# EAGLE design FixedItFinalFinal (EAGLE 9.6.2)
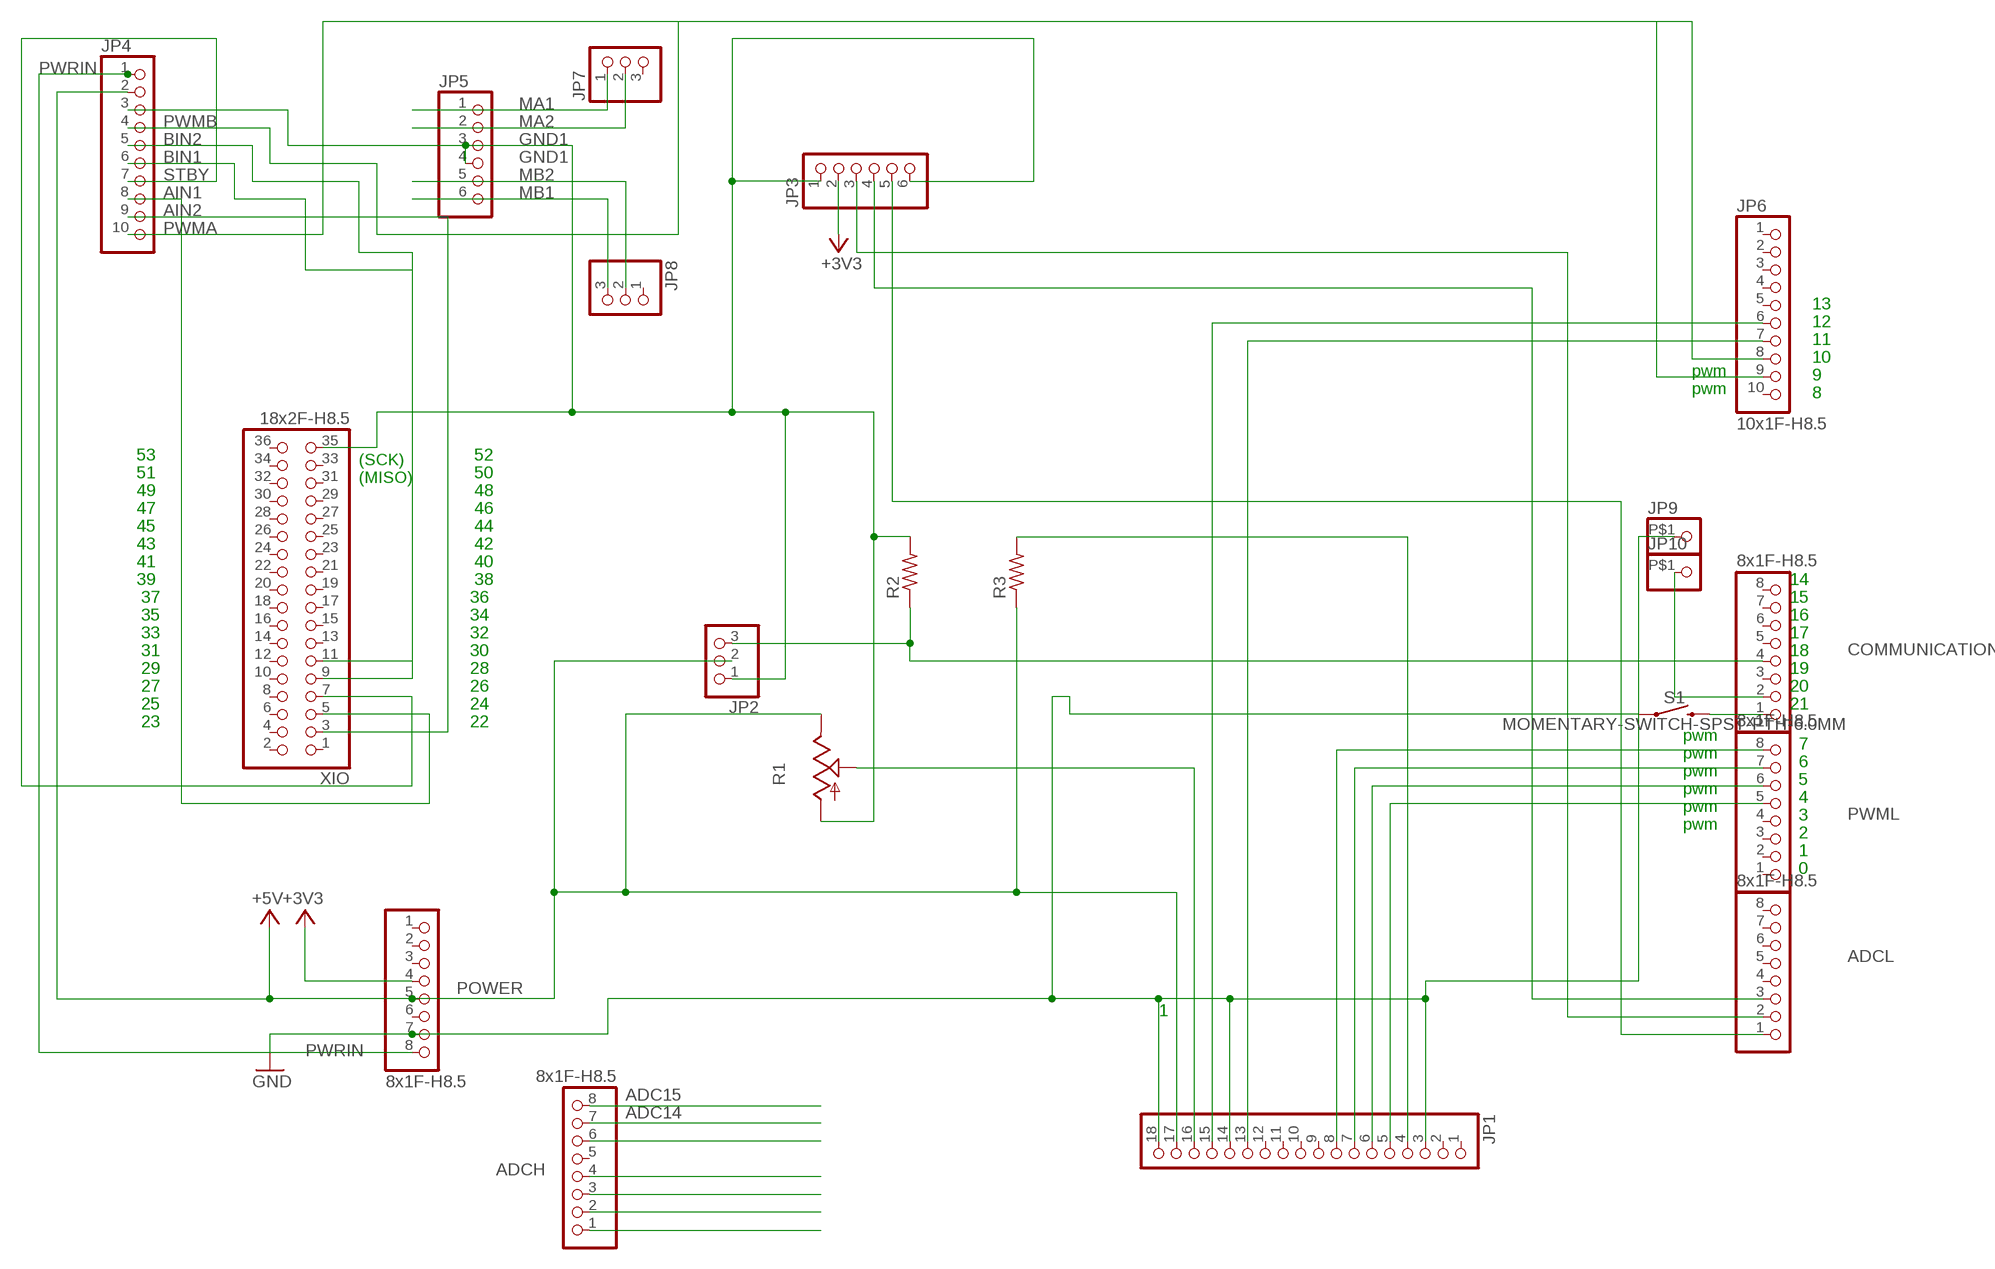
[diagram p0: schematic, sheet 1]

## Parts
ADCH  8x1F-H8.5  PINHD-1X8  [1X08]
ADCL  8x1F-H8.5  PINHD-1X8  [1X08]
COMMUNICATION  8x1F-H8.5  PINHD-1X8  [1X08]
JP1  PINHD-1X18  [1X18]
JP2  PINHD-1X3  [1X03]
JP3  PINHD-1X6  [1X06]
JP4  HEADER-1X10THICKER  [1X10_ROUND_76]
JP5  PINHD-1X6CB  [1X06-CLEANBIG]
JP6  10x1F-H8.5  PINHD-1X10_ARD  [1X10]
JP7  PINHD-1X3  [1X03]
JP8  PINHD-1X3  [1X03]
JP9  PINHD-1X1-BIGPOGO  [1X1-BIGPOGO]
JP10  PINHD-1X1-BIGPOGO  [1X1-BIGPOGO]
POWER  8x1F-H8.5  PINHD-1X8  [1X08]
PWML  8x1F-H8.5  PINHD-1X8  [1X08]
R1  TRIM_US-RS3  [RS3]
R2  R-US_0204/7  [0204/7]
R3  R-US_0204/7  [0204/7]
S1  MOMENTARY-SWITCH-SPST-PTH-6.0MM  [TACTILE_SWITCH_PTH_6.0MM]
XIO  18x2F-H8.5  PINHD-2X18  [2X18]

## Nets
+3V3 [power]: JP3.2 POWER.4
+5V [power usb]: JP1.17 JP2.2 JP4.2 POWER.5 R1.E R3.1
ADC8: ADCH.1
ADC9: ADCH.2
ADC10: ADCH.3
ADC11: ADCH.4
ADC13: ADCH.6
ADC14: ADCH.7
ADC15: ADCH.8
AIN1: JP4.8 XIO.5
AIN2: JP4.9 XIO.3
BIN1: JP4.6 XIO.9
BIN2: JP4.5 XIO.11
GND [gnd]: JP1.3 JP1.14 JP1.18 JP9.P$1 POWER.7 S1.1
GND1: JP2.1 JP3.1 JP3.6 JP4.3 JP5.3 JP5.4 R1.A R2.2 XIO.35
MA1: JP5.1 JP7.1
MA2: JP5.2 JP7.2
MB1: JP5.6 JP8.3
MB2: JP5.5 JP8.2
N$1: JP1.5 PWML.5
N$2: JP1.6 PWML.6
N$3: JP1.7 PWML.7
N$4: JP1.8 PWML.8
N$5: JP1.13 JP6.7
N$6: JP1.15 JP6.6
N$7: JP1.16 R1.S
N$8: ADCL.1 JP3.5
N$9: JP1.4 R3.2
N$10: COMMUNICATION.1 S1.3
N$11: ADCL.2 JP3.3
N$12: ADCL.3 JP3.4
N$13: COMMUNICATION.2 JP10.P$1
N$14: COMMUNICATION.4 JP2.3 R2.1
PWMA: JP4.10 JP6.8
PWMB: JP4.4 JP6.9
PWRIN: JP4.1 POWER.8
STBY: JP4.7 XIO.7
Unconnected: ADCH.5 ADCL.4 ADCL.5 ADCL.6 ADCL.7 ADCL.8 COMMUNICATION.3 COMMUNICATION.5 COMMUNICATION.6 COMMUNICATION.7 COMMUNICATION.8 JP1.1 JP1.2 JP1.9 JP1.10 JP1.11 JP1.12 JP6.1 JP6.2 JP6.3 JP6.4 JP6.5 JP6.10 JP7.3 JP8.1 POWER.1 POWER.2 POWER.3 POWER.6 PWML.1 PWML.2 PWML.3 PWML.4 XIO.1 XIO.2 XIO.4 XIO.6 XIO.8 XIO.10 XIO.12 XIO.13 XIO.14 XIO.15 XIO.16 XIO.17 XIO.18 XIO.19 XIO.20 XIO.21 XIO.22 XIO.23 XIO.24 XIO.25 XIO.26 XIO.27 XIO.28 XIO.29 XIO.30 XIO.31 XIO.32 XIO.33 XIO.34 XIO.36

## Notes on the sheet
- 13
- 12
- 11
- 10
- pwm | 9
- pwm | 8
- 53 | (SCK) | 52
- 51 | (MISO) | 50
- 49 | 48
- 47 | 46
- 45 | 44
- 43 | 42
- 41 | 40
- 39 | 38 | 14
- 37 | 36 | 15
- 35 | 34 | 16
- 33 | 32 | 17
- 31 | 30 | 18
- 29 | 28 | 19
- 27 | 26 | 20
- 25 | 24 | 21
- 23 | 22
- pwm
- 7
- pwm
- 6
- pwm
- 5
- pwm
- 4
- pwm
- 3
- pwm
- 2
- 1
- 0
- 1

## Library data of the parts
ADCH ADCL COMMUNICATION POWER PWML = SmartPrj:PINHD-1X8: PIN HEADER
JP1 = adafruit:PINHD-1X18: PIN HEADER
JP2 JP7 JP8 = adafruit:PINHD-1X3: PIN HEADER
JP3 JP5 = adafruit:PINHD-1X6: PIN HEADER
JP4 = microbuilder:HEADER-1X10: PIN HEADER
JP6 = SmartPrj:PINHD-1X10_ARD: PIN HEADER
JP9 JP10 = adafruit:PINHD-1X1: Pin header 1x1 for 0.1" spacing With round pins
R1 = pot:TRIM_US-: POTENTIOMETER
R2 R3 = adafruit:R-US_: RESISTOR, American symbol
S1 = SparkFun-Switches:MOMENTARY-SWITCH-SPST: Momentary Switch (Pushbutton) - SPST Normally-open (NO) SPST momentary switches (buttons, pushbuttons). Variants PTH-12MM - 12mm square, through-hole Momentary Pushbutton Switch - 12mm Square <https://www.sparkfun.com/products/9190> (COM-09190) PTH-6.0MM, PTH-6.0MM-KIT - 6.0mm square, through-hole Mini Pushbutton Switch <https://www.sparkfun.com/products/97> (COM-00097) KIT package intended for soldering kit's - only one side of pads' copper is exposed. PTH-RIGHT-ANGLE-KIT - Right-angle, through-hole Right Angle Tactile Button <https://www.sparkfun.com/products/10791> - Used on SparkFun BigTime Watch Kit <https://www.sparkfun.com/products/11734> SMD-12MM - 12mm square, surface-mount Tactile Button - SMD (12mm) <https://www.sparkfun.com/products/12993> (COM-12993) Used on SparkFun PicoBoard <https://www.sparkfun.com/products/11888> SMD-4.5MM - 4.5mm Square Trackball Switch Used on SparkFun Blackberry Trackballer Breakout <https://www.sparkfun.com/products/13169> SMD-4.6MMX2.8MM - 4.60mm x 2.80mm, surface mount Used on SparkFun SAMD21 Mini Breakout <https://www.sparkfun.com/products/13664> SMD-5.2MM, SMD-5.2-REDUNDANT - 5.2mm square, surface-mount Mini Pushbutton Switch - SMD <https://www.sparkfun.com/products/8720> (COM-08720) Used on Arduino Pro Mini <https://www.sparkfun.com/products/11114> REDUNDANT package connects both switch circuits together SMD-6.0X3.5MM - 6.0 x 3.5mm, surface mount Momentary Reset Switch SMD <https://www.sparkfun.com/products/8229> (COM-08229) SMD-6.2MM-TALL - 6.2mm square, surface mount Tactile Button - SMD (6mm) <https://www.sparkfun.com/products/12992> Used on SparkFun Digital Sandbox <https://www.sparkfun.com/products/12651> SMD-RIGHT-ANGLE - Right-angle, surface mount Used on SparkFun Block for Intel® Edison - Arduino <https://www.sparkfun.com/products/13036>; PROD_ID: SWCH-08441; SF_SKU: COM-00097
XIO = SmartPrj:PINHD-2X18: PIN HEADER

## Net classes
1 power: width 0.61 mm, drill 0.406 mm, clearance 0.203 mm
2 gnd: width 0.305 mm, drill 0.406 mm, clearance 0.203 mm
3 power usb: width 0.508 mm, drill 0.406 mm, clearance 0.203 mm

## Board
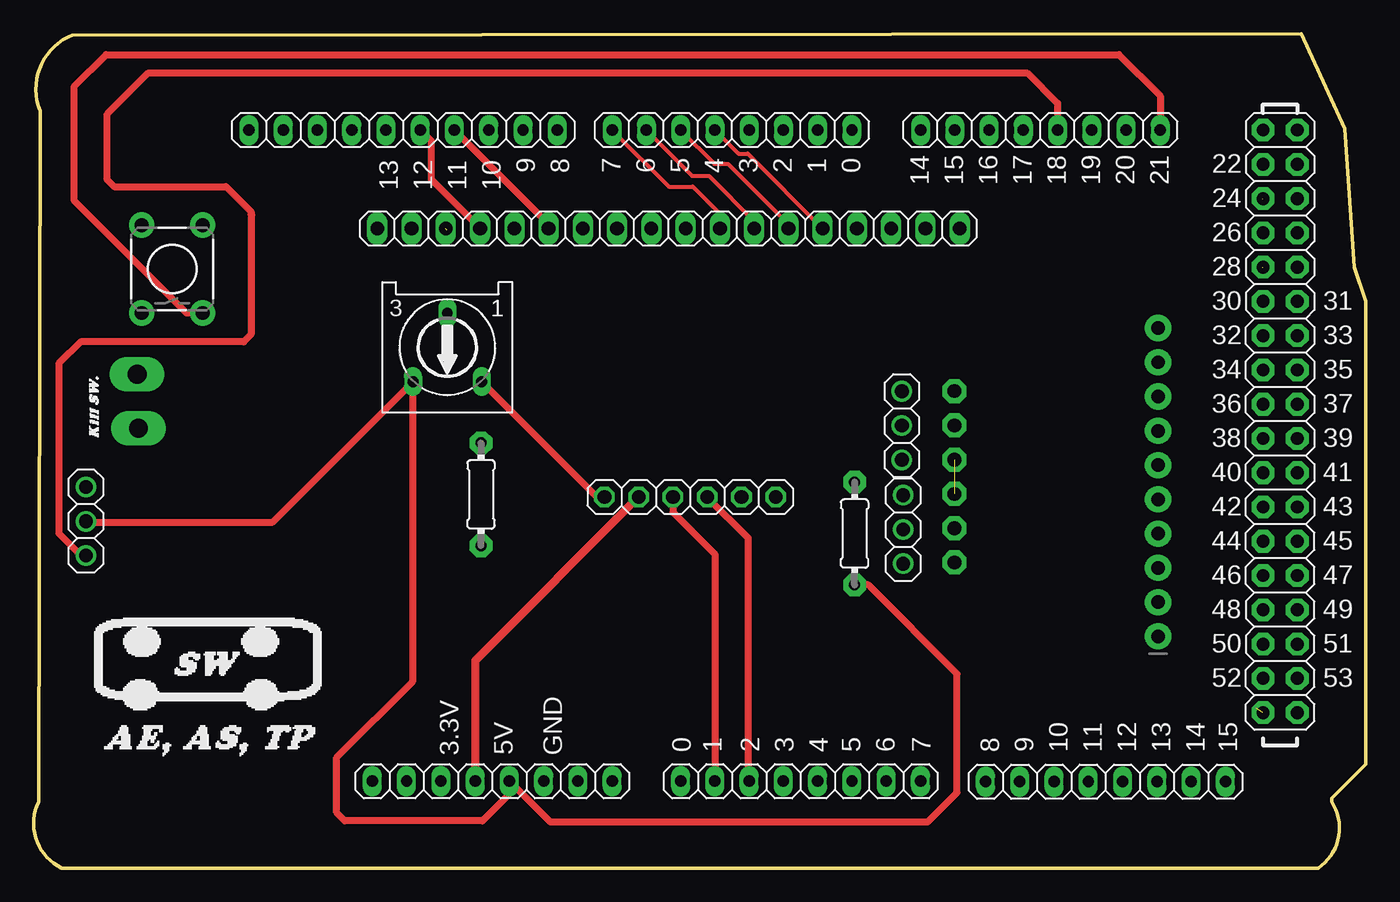
[diagram p1: board, top side]
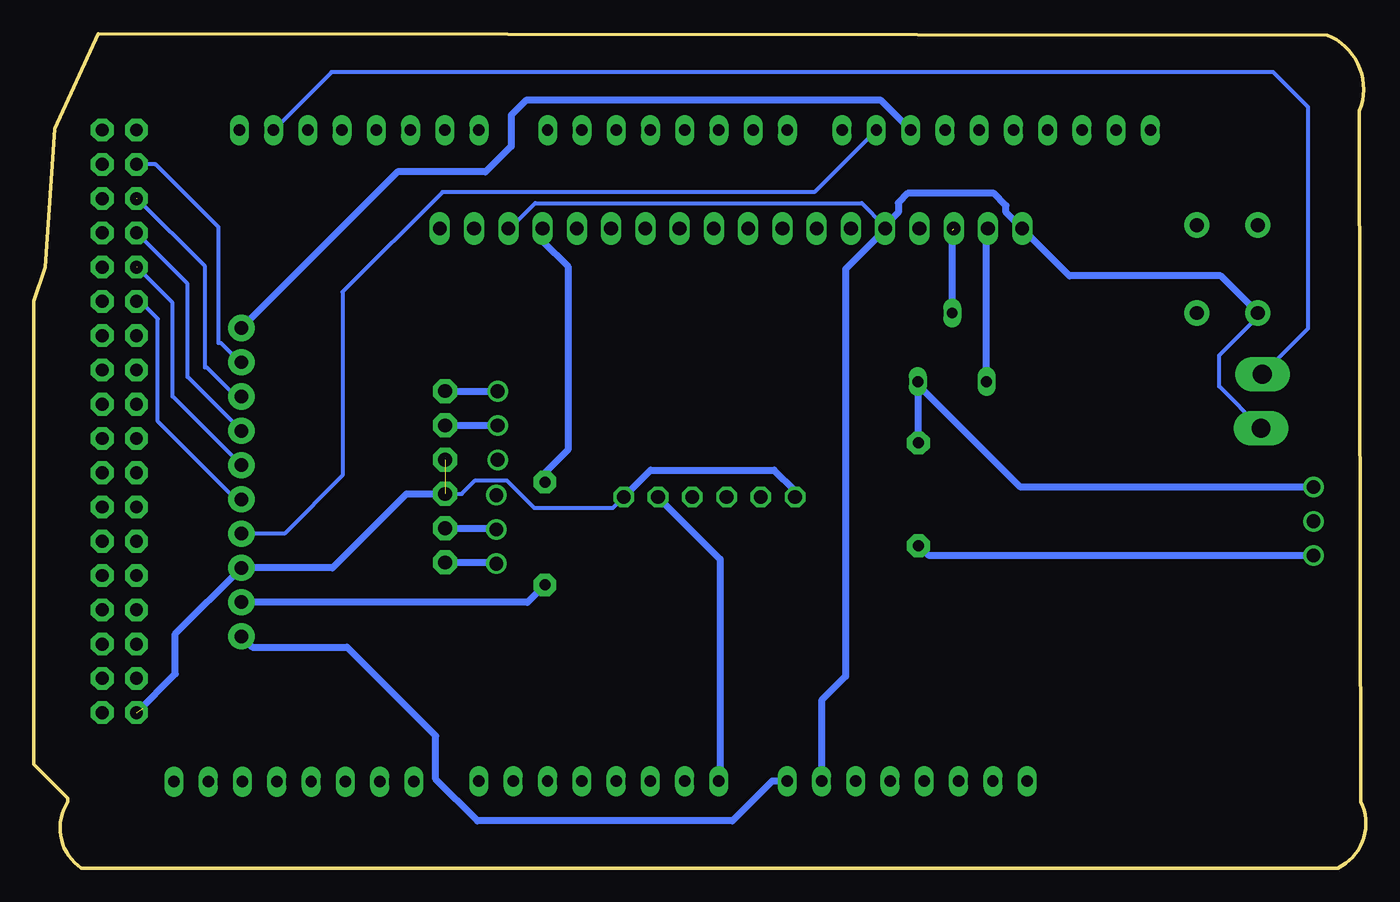
[diagram p2: board, bottom side, seen from below]

Size 98.77 x 61.84 mm. Coordinates in mm from the lower left corner, seen from the top.
Outline: 93.99,61.84 97.23,54.8 97.93,44.54 98.77,42 98.77,7.71 96.23,5.17 96.23,4.9 arc-90 95.23,0 2.07,0 arc-90 0.37,4.9 0.47,56.14 arc-90 2.87,61.74 93.99,61.84
Copper layers (1*16): Top 0.035mm / dielectric 1.5mm / Bottom 0.035mm
Design rules "default": minimum track width 8mil, minimum drill 16mil, track to track 7mil, track to pad 7mil, pad to pad 8mil, via to via 10mil, smd to smd 7mil, copper to edge 27mil, drill to drill 12mil, minimum pad ring 10mil, minimum via ring 10mil, stop-mask expansion 2mil, vias tented up to drill 24mil, thermal gap 10mil

### Footprints (pad centres in the part's own frame; a part is rotated, then mirrored left to right if it is on the bottom)
1X08 = drill 0.85 pad 1.422 long: 1 -8.89,0; 2 -6.35,0; 3 -3.81,0; 4 -1.27,0; 5 1.27,0; 6 3.81,0; 7 6.35,0; 8 8.89,0
1X18 = drill 1.016 long: 1 -21.59,0; 2 -19.05,0; 3 -16.51,0; 4 -13.97,0; 5 -11.43,0; 6 -8.89,0; 7 -6.35,0; 8 -3.81,0; 9 -1.27,0; 10 1.27,0; 11 3.81,0; 12 6.35,0; 13 8.89,0; 14 11.43,0; 15 13.97,0; 16 16.51,0; 17 19.05,0; 18 21.59,0
1X03 = drill 1.016: 1 -2.54,0; 2 0,0; 3 2.54,0
1X06 = drill 1.016 octagon: 1 -6.35,0; 2 -3.81,0; 3 -1.27,0; 4 1.27,0; 5 3.81,0; 6 6.35,0
1X10_ROUND_76 = drill 1 pad 1.93: 1 -11.43,0; 2 -8.89,0; 3 -6.35,0; 4 -3.81,0; 5 -1.27,0; 6 1.27,0; 7 3.81,0; 8 6.35,0; 9 8.89,0; 10 11.43,0
1X06-CLEANBIG = drill 1.016 pad 1.778 octagon: 1 -6.35,0; 2 -3.81,0; 3 -1.27,0; 4 1.27,0; 5 3.81,0; 6 6.35,0
1X10 = drill 0.85 pad 1.422 long: 1 -11.43,0; 2 -8.89,0; 3 -6.35,0; 4 -3.81,0; 5 -1.27,0; 6 1.27,0; 7 3.81,0; 8 6.35,0; 9 8.89,0; 10 11.43,0
1X1-BIGPOGO = drill 1.4 pad 2.54 long: P$1 0,0
RS3 = drill 0.813 long: A -2.54,2.54; E 2.54,2.54; S 0,-2.54
0204/7 = drill 0.813 pad 1.676 octagon: 1 -3.81,0; 2 3.81,0
TACTILE_SWITCH_PTH_6.0MM = drill 1.016 pad 1.88: 1 -3.251,2.261; 2 3.251,2.261; 3 -3.251,-2.261; 4 3.251,-2.261
2X18 = drill 0.95 pad 1.676 octagon: 1 -21.59,-1.27; 2 -21.59,1.27; 3 -19.05,-1.27; 4 -19.05,1.27; 5 -16.51,-1.27; 6 -16.51,1.27; 7 -13.97,-1.27; 8 -13.97,1.27; 9 -11.43,-1.27; 10 -11.43,1.27; 11 -8.89,-1.27; 12 -8.89,1.27; 13 -6.35,-1.27; 14 -6.35,1.27; 15 -3.81,-1.27; 16 -3.81,1.27; 17 -1.27,-1.27; 18 -1.27,1.27; 19 1.27,-1.27; 20 1.27,1.27; 21 3.81,-1.27; 22 3.81,1.27; 23 6.35,-1.27; 24 6.35,1.27; 25 8.89,-1.27; 26 8.89,1.27; 27 11.43,-1.27; 28 11.43,1.27; 29 13.97,-1.27; 30 13.97,1.27; 31 16.51,-1.27; 32 16.51,1.27; 33 19.05,-1.27; 34 19.05,1.27; 35 21.59,-1.27; 36 21.59,1.27

### Placement (x,y rotation side)
ADCH  79.47,6.4 0 top
ADCL  56.86,6.44 0 top
COMMUNICATION  74.64,54.7 180 top
JP1  47.07,47.4 180 top
JP2  3.87,25.7 270 top
JP3  48.67,27.5 0 top
JP4  83.37,28.6 90 top
JP5  68.27,29 90 top
JP6  27.39,54.7 0 top
JP7  64.47,25.1 90 top
JP8  64.37,32.8 90 top
JP9  7.77,32.6 0 top
JP10  7.67,36.6 0 top
POWER  34,6.44 0 top
PWML  51.78,54.7 180 top
R1  30.67,38.6 180 top
R2  33.17,27.7 90 top
R3  60.87,24.8 90 top
S1  10.27,44.4 90 top
XIO  92.42,33.11 270 top

### Tracks (layer width: path | path; a pad name or v marks a point on that pad's centre or on a via)
+3V3
  Top 0.61: POWER.4 32.73,15.38 44.82,27.47 JP3.2
+5V
  Top 0.508: 28.05,36.11 R1.E | 27.85,36.01 R1.E | R1.E 28.13,13.86 22.47,8.2 22.47,4.1 23.07,3.5 33.27,3.5 35.27,5.5 POWER.5 38.31,3.4 66.27,3.4 68.47,5.6 68.47,14.4 61.88,20.99 R3.1 | R1.E 17.67,25.6 3.97,25.6 JP2.2
  Bottom 0.508: R3.1 62.16,19.7 JP4.2 | R1.E 28.13,47.29 JP1.17
AIN1  (1 unrouted)
  Bottom 0.305: JP4.8 83.77,34.95 85.92,37.1 86.07,37.1 86.07,44.6 91.09,49.62
AIN2
  Bottom 0.305: JP4.9 83.47,37.49 84.88,38.9 85.07,38.9 85.07,47.5 89.73,52.16 XIO.3
BIN1  (1 unrouted)
  Bottom 0.305: JP4.6 88.47,34.97 88.47,41.9 91.11,44.54
BIN2
  Bottom 0.305: JP4.5 83.8,27.33 89.57,33.1 89.57,40.7 90.87,42 XIO.11
GND
  Bottom 0.305: 26.02,47.49 25.51,47.49 JP1.18 | 35.57,47.49 JP1.14 | 63,47.49 63.38,47.49 | JP1.3 63.51,47.49 63.38,47.49 | JP1.14 35.67,47.59 37.37,49.28 61.59,49.28 63.38,47.49 | JP1.14 35.67,47.28 | JP9.P$1 10.87,35.7 10.87,38 8.01,40.86 S1.1
  Bottom 0.508: POWER.7 40.35,12.42 38.57,14.2 38.57,44.39 35.67,47.28 | S1.1 10.76,43.9 21.98,43.9 JP1.18 26.67,48.59 26.67,49.1 27.57,50 33.97,50 34.67,49.3 34.67,48.59 35.67,47.59
GND1  (2 unrouted)
  Top 0.305: 41.77,27.57 42.28,27.57 JP3.1
  Top 0.508: 41.77,27.57 41.69,27.57 R1.A
  Bottom 0.305: 42.38,27.57 JP3.1 | 90.54,11.93 90.64,11.86 | 68.67,27.73 JP5.3 67.04,27.73 66.04,28.73 63.7,28.73 61.67,26.7 55.82,26.7 JP3.6 55.02,27.85
  Bottom 0.508: XIO.35 88.27,14.4 88.27,17.35 JP4.3 76.62,22.25 71.14,27.73 JP5.3 | JP2.1 25.61,28.24 33.21,35.84 R1.A 33.21,31.55 R2.2 | JP3.6 53.02,29.5 43.87,29.5 42.38,28.01 42.38,27.57
MA1
  Bottom 0.508: JP5.1 64.56,22.65 JP7.1
MA2
  Bottom 0.508: JP5.2 64.56,25.19 JP7.2
MB1
  Bottom 0.508: JP5.6 JP8.3
MB2
  Bottom 0.508: JP5.5 JP8.2
N$1
  Top 0.203: 58.43,47.49 JP1.5
  Top 0.305: PWML.5 52.26,52.95 52.95,52.95 JP1.5
N$2
  Top 0.203: 55.89,47.49 JP1.6
  Top 0.305: PWML.6 50.47,52.2 51.47,52.2 55.96,47.71 JP1.6
N$3
  Top 0.203: 53.35,47.49 JP1.7
  Top 0.305: PWML.7 48.83,51.3 50.07,51.3 53.42,47.95 JP1.7
N$4
  Top 0.203: 50.81,47.49 JP1.8
  Top 0.305: PWML.8 47.09,50.5 48.87,50.5 50.88,48.49 JP1.8
N$5
  Top 0.203: 31.2,54.39 JP6.7 | 38.11,47.49 JP1.13
  Top 0.508: JP6.7 38.11,47.79 38.11,47.49
N$6
  Top 0.203: 33.03,47.49 JP1.15
  Top 0.508: JP6.6 29.47,53.9 29.47,51.05 33.03,47.49
N$7  (1 unrouted)
  Bottom 0.508: R1.S 30.67,47.29
N$8
  Bottom 0.203: 52.44,27.47 JP3.5
  Bottom 0.508: JP3.5 47.87,22.89 47.87,6.54 ADCL.1
N$9
  Bottom 0.305: 60.77,28.71 R3.2
  Bottom 0.508: JP1.4 61.04,46.47 59.17,44.6 59.17,31 60.87,29.3 R3.2
N$10
  Top 0.508: S1.3 11.32,41.15 3.02,49.45 3.02,57.95 5.37,60.3 80.47,60.3 83.53,57.24 COMMUNICATION.1
N$11
  Top 0.203: 47.46,27.47 JP3.3
  Top 0.508: JP3.3 47.4,26.37 50.51,23.26 ADCL.2
N$12
  Top 0.508: JP3.4 52.97,24.47 52.97,6.52 ADCL.3
N$13
  Bottom 0.305: COMMUNICATION.2 76.69,59 8.57,59 6.87,59 4.27,56.4 4.27,40 JP10.P$1
N$14
  Top 0.305: 3.47,22.9 3.61,22.9 JP2.3 | 5.47,51 5.47,51.3
  Top 0.508: JP2.3 3.51,23.16 1.87,24.8 1.87,37.4 3.47,39 15.57,39 16.12,39.55 16.12,48.45 | 16.17,48.4 16.12,48.45 | 16.12,48.45 16.12,48.65 14.27,50.5 5.97,50.5 5.47,51 5.47,55.9 8.47,58.9 73.71,58.9 75.91,56.7 COMMUNICATION.4
  Bottom 0.203: 33.08,23.91 33.12,23.9 R2.1
  Bottom 0.508: JP2.3 32.38,23.16 33.12,23.9
PWMA
  Bottom 0.508: JP6.8 35.94,56.9 62.27,56.9 63.37,55.8 63.37,53.5 65.27,51.6 71.8,51.6 JP4.10
PWMB
  Bottom 0.305: JP6.9 40.88,50.1 68.47,50.1 75.87,42.7 75.87,29.1 80.18,24.79 JP4.4
PWRIN
  Bottom 0.508: POWER.8 44.03,6.44 46.97,3.5 65.87,3.5 68.97,6.6 68.97,9.8 75.54,16.37 82.57,16.37 JP4.1
STBY
  Bottom 0.305: JP4.7 87.37,36.41 87.37,43.3 XIO.7

### Text on the board
tPlace: 9 | 8 | 7 | 6 | 5 | 4 | 3 | 2 | 1 | 0 | 22 | 14 | 15 | 16 | 17 | 18 | 19 | 20 | 21 | 13 | 12 | 11 | 10 | 24 | 26 | 28 | 30 | 31 | 32 | 33 | 34 | 35 | 36 | 37 | 38 | 39 | 40 | 41 | 42 | 43 | 44 | 45 | 46 | 47 | 48 | 49 | 50 | 51 | 52 | 53 | 0 | 1 | 2 | 3 | 4 | 5 | 6 | 7 | 8 | 9 | 10 | 11 | 12 | 13 | 14 | 15 | 3.3V | 5V | GND